# EAGLE design VPThermo (EAGLE 7.7.0)
Assembly variants: MAIN
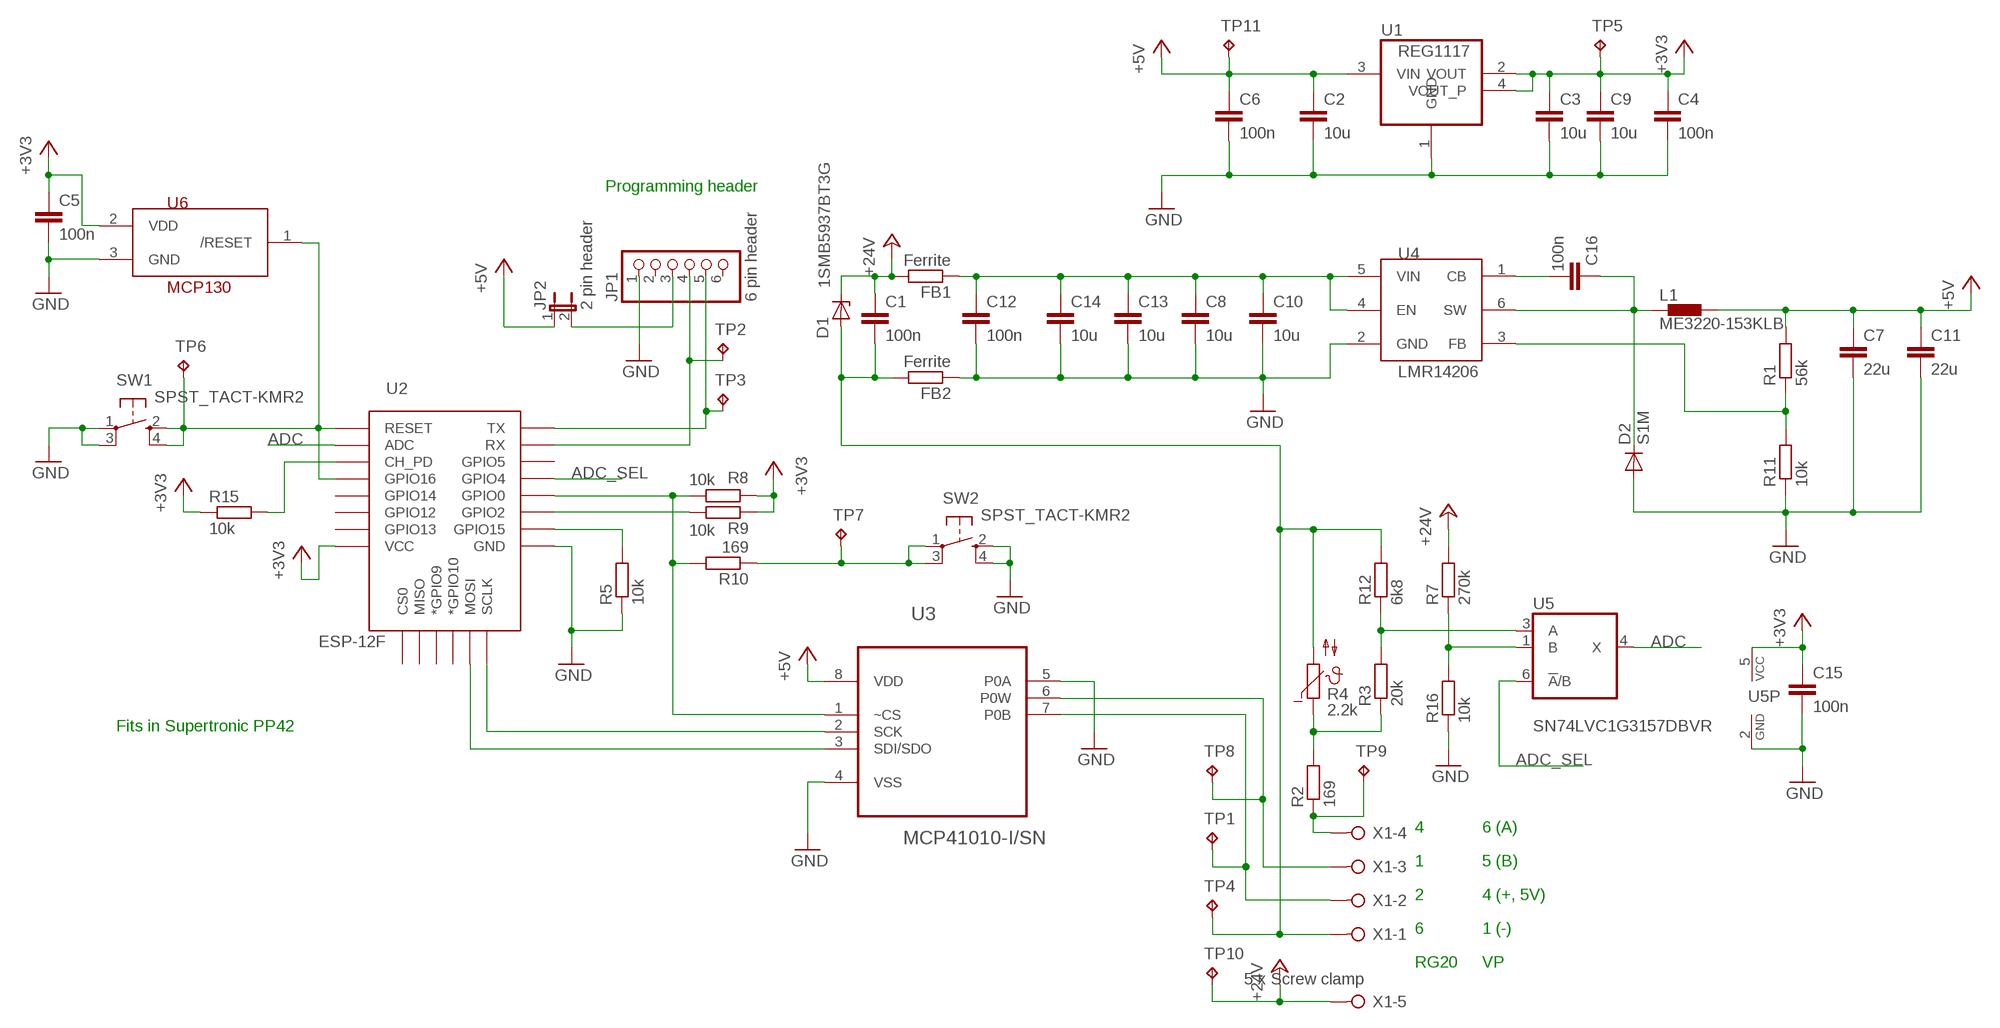
[diagram p0: schematic, sheet 1]

## Parts
C1  100n  C-EUC0603  [C0603]
C2  10u  C-EUC0805  [C0805]
C3  10u  C-EUC0805  [C0805]
C4  100n  C-EUC0603  [C0603]
C5  100n  C-EUC0603  [C0603]
C6  100n  C-EUC0603  [C0603]
C7  22u  C-EUC0805  [C0805]
C8  10u  C-EUC0805  [C0805]
C9  10u  C-EUC0805  [C0805]
C10  10u  C-EUC0805  [C0805]
C11  22u  C-EUC0805  [C0805]
C12  100n  C-EUC0603  [C0603]
C13  10u  C-EUC0805  [C0805]
C14  10u  C-EUC0805  [C0805]
C15  100n  C-EUC0603  [C0603]
C16  100n  C-EUC0603  [C0603]
D1  1SMB5937BT3G  ZENER-DIODESMB  [SMB]
D2  S1M  [SMA]
FB1  Ferrite  RR0603  [R0603]
FB2  Ferrite  RR0603  [R0603]
JP1  6 pin header  PINHD-1X6  [1X06]
JP2  2 pin header  JP1E  [JP1]
L1  ME3220-153KLB  SDR0302  [SDR0302]
R1  56k  RR0603  [R0603]
R2  169  RR0603  [R0603]
R3  20k  RR0603  [R0603]
R4  2.2k  NTC640  [P640]
R5  10k  RR0603  [R0603]
R7  270k  RR0603  [R0603]
R8  10k  RR0603  [R0603]
R9  10k  RR0603  [R0603]
R10  169  RR0603  [R0603]
R11  10k  RR0603  [R0603]
R12  6k8  RR0603  [R0603]
R15  10k  RR0603  [R0603]
R16  10k  RR0603  [R0603]
SW1  SPST_TACT-KMR2  [KMR2]
SW2  SPST_TACT-KMR2  [KMR2]
TP1  TPB1,27  [B1,27]  (not fitted in variant MAIN)
TP2  TPB1,27  [B1,27]  (not fitted in variant MAIN)
TP3  TPB1,27  [B1,27]  (not fitted in variant MAIN)
TP4  TPB1,27  [B1,27]  (not fitted in variant MAIN)
TP5  TPB1,27  [B1,27]  (not fitted in variant MAIN)
TP6  TPB1,27  [B1,27]  (not fitted in variant MAIN)
TP7  TPB1,27  [B1,27]  (not fitted in variant MAIN)
TP8  TPB1,27  [B1,27]  (not fitted in variant MAIN)
TP9  TPB1,27  [B1,27]  (not fitted in variant MAIN)
TP10  TPB1,27  [B1,27]  (not fitted in variant MAIN)
TP11  TPB1,27  [B1,27]  (not fitted in variant MAIN)
U1  REG1117  [SOT223]
U2  ESP-12F  ESP12ESMD  [ESP12E-SMD]  (not fitted in variant MAIN)
U3  MCP41010-I/SN  MCP4151-103E/SN  [SOIC127P600X175-8N]
U4  LMR14206  [SOT-23-6]
U5  SN74LVC1G3157DBVR  741G3157DBVR  [DBV_R-PDSO-G6]
U6  MCP130  [SOT23]
X1  5 x Screw clamp  W237-05P  [W237-5P]

## Nets
+3V3: C3.1 C4.1 C5.1 C9.1 C15.1 R8.1 R9.1 R15.1 TP5.TP U1.2(VOUT) U1.4(VOUT_P) U2.VCC U5.5(VCC) U6.2(VDD)
+5V: C2.1 C6.1 C7.1 C11.1 JP2.1 L1.2 R1.2 TP11.TP U1.3(VIN) U3.8(VDD)
+24V: C1.1 D1.C FB1.2 R7.2 TP10.TP X1.5
ADC: U2.ADC U5.4(X)
ADC_SEL: U2.GPIO4 U5.6(!A!/B)
GND: C2.2 C3.2 C4.2 C5.2 C6.2 C7.2 C8.2 C9.2 C10.2 C11.2 C12.2 C13.2 C14.2 C15.2 D2.A FB2.1 JP1.1 R5.1 R11.1 R16.1 SW1.1(P) SW1.3(P1) SW2.2(S) SW2.4(S1) U1.1(GND) U2.GND U3.4(VSS) U3.5(P0A) U4.2(GND) U5.2(GND) U6.3(GND)
N$1: R10.1 SW2.1(P) SW2.3(P1) TP7.TP
N$2: U2.MOSI U3.3(SDI/SDO)
N$3: C16.2 U4.1(CB)
N$4: JP1.3 JP2.2
N$5: U2.SCLK U3.2(SCK)
N$6: JP1.4 TP2.TP U2.RXD0(RX)
N$7: JP1.5 TP3.TP U2.TXD0(TX)
N$9: R3.2 R12.1 U5.3(A)
N$10: TP8.TP U3.6(P0W) X1.3
N$11: R2.2 R3.1 R4.1
N$12: R2.1 TP9.TP X1.4
N$13: R5.2 U2.GPIO15
N$14: C8.1 C10.1 C12.1 C13.1 C14.1 FB1.1 U4.4(EN) U4.5(VIN)
N$15: TP1.TP U3.7(P0B) X1.2
N$16: R8.2 R10.2 U2.GPIO0 U3.1(~CS)
N$17: R9.2 U2.GPIO2
N$18: C1.2 D1.A FB2.2 R4.2 R12.2 TP4.TP X1.1
N$19: R1.1 R11.2 U4.3(FB)
N$20: R15.2 U2.CH_PD
N$21: R7.1 R16.2 U5.1(B)
N$22: SW1.2(S) SW1.4(S1) TP6.TP U2.GPIO16 U2.RESET U6.1(/RESET)
N$23: C16.1 D2.C L1.1 U4.6(SW)
Unconnected: JP1.2 JP1.6 U2.CS0 U2.GPIO5 U2.GPIO9(*GPIO9) U2.GPIO10(*GPIO10) U2.GPIO12 U2.GPIO13 U2.GPIO14 U2.MISO

## Notes on the sheet
- Programming header
- Fits in Supertronic PP42
- 4 | 6 (A)
- 1 | 5 (B)
- 2 | 4 (+, 5V)
- 6 | 1 (-)
- RG20 | VP

## Library data of the parts
C1 C4-C6 C12 C15 C16 = rcl:C-EU: CAPACITOR, European symbol; OC_FARNELL: 1759122
C2 C3 C8-C10 C13 C14 = resistor:C-EU: CAPACITOR, European symbol; OC_FARNELL: 2611943
C7 C11 = resistor:C-EU: CAPACITOR, European symbol; OC_FARNELL: 2309030
D1 = diode:ZENER-DIODE: Z-Diode; OC_FARNELL: 1431179
D2 = diode:S1M
FB1 FB2 = eagle-ltspice:R: RESISTOR, European symbol; OC_FARNELL: 1635706; SPICEMODEL: NONE; SPICEPREFIX: R
JP1 = adafruit:PINHD-1X6: PIN HEADER; OC_FARNELL: 1593415
JP2 = jumper:JP1E: JUMPER; OC_FARNELL: 1593411
L1 = ola_inductor:SDR0302; OC_FARNELL: 2287926
R1 = eagle-ltspice:R: RESISTOR, European symbol; OC_FARNELL: 2303215; SPICEMODEL: NONE; SPICEPREFIX: R
R2 R10 = eagle-ltspice:R: RESISTOR, European symbol; OC_FARNELL: 2303081; SPICEMODEL: NONE; SPICEPREFIX: R
R3 = eagle-ltspice:R: RESISTOR, European symbol; OC_FARNELL: 2447293; SPICEMODEL: NONE; SPICEPREFIX: R
R4 = ptc-ntc:NTC640: PHILIPS NTC; OC_FARNELL: 1187025; OC_NEWARK: unknown
R5 R8 R9 R11 R15 R16 = eagle-ltspice:R: RESISTOR, European symbol; OC_FARNELL: 2447230; SPICEMODEL: NONE; SPICEPREFIX: R
R7 = eagle-ltspice:R: RESISTOR, European symbol; OC_FARNELL: 2447313; SPICEMODEL: NONE; SPICEPREFIX: R
R12 = eagle-ltspice:R: RESISTOR, European symbol; OC_FARNELL: 2447427; SPICEMODEL: NONE; SPICEPREFIX: R
SW1 SW2 = adafruit:SPST_TACT: SMT 6mm switch, EVQQ2 series http://www.ladyada.net/library/eagle; OC_FARNELL: 1437636
TP1-TP11 = testpad:TP: Test pad
U1 = burr-brown:REG1117: 800mA and 1A Low Dropout (LDO) Positive Regulator 1.8V, 2.5V, 2.85V, 3.3V, 5V, and Adj; MPN: REG1117; OC_FARNELL: 1825376; OC_NEWARK: 14P6981
U2 = esp8266modules:ESP12E: ESP12E Module
U3 = digitalpot-microchip:MCP4151-103E/SN: Digital POT; MPN: MCP41010-I/SN; OC_FARNELL: 9758607; PACKAGE: SOIC-8; SUPPLIER: Microchip
U4 = ola_texas:LMR14206: LMR14206 SIMPLE SWITCHER® 42Vin, 0.6A Step-Down Voltage Regulator in SOT-23
U5 = 74xx-little-us:74*1G3157: Single-Pole, Double-Throw Analog Switch Source: http://focus.ti.com/lit/ds/symlink/sn74lvc1g3157.pdf; OC_FARNELL: 1470910
U6 = ola-microchip:MCP130
X1 = con-wago-508:W237-05P: WAGO SREW CLAMP; OC_FARNELL: 1717004; OC_NEWARK: unknown

## Board
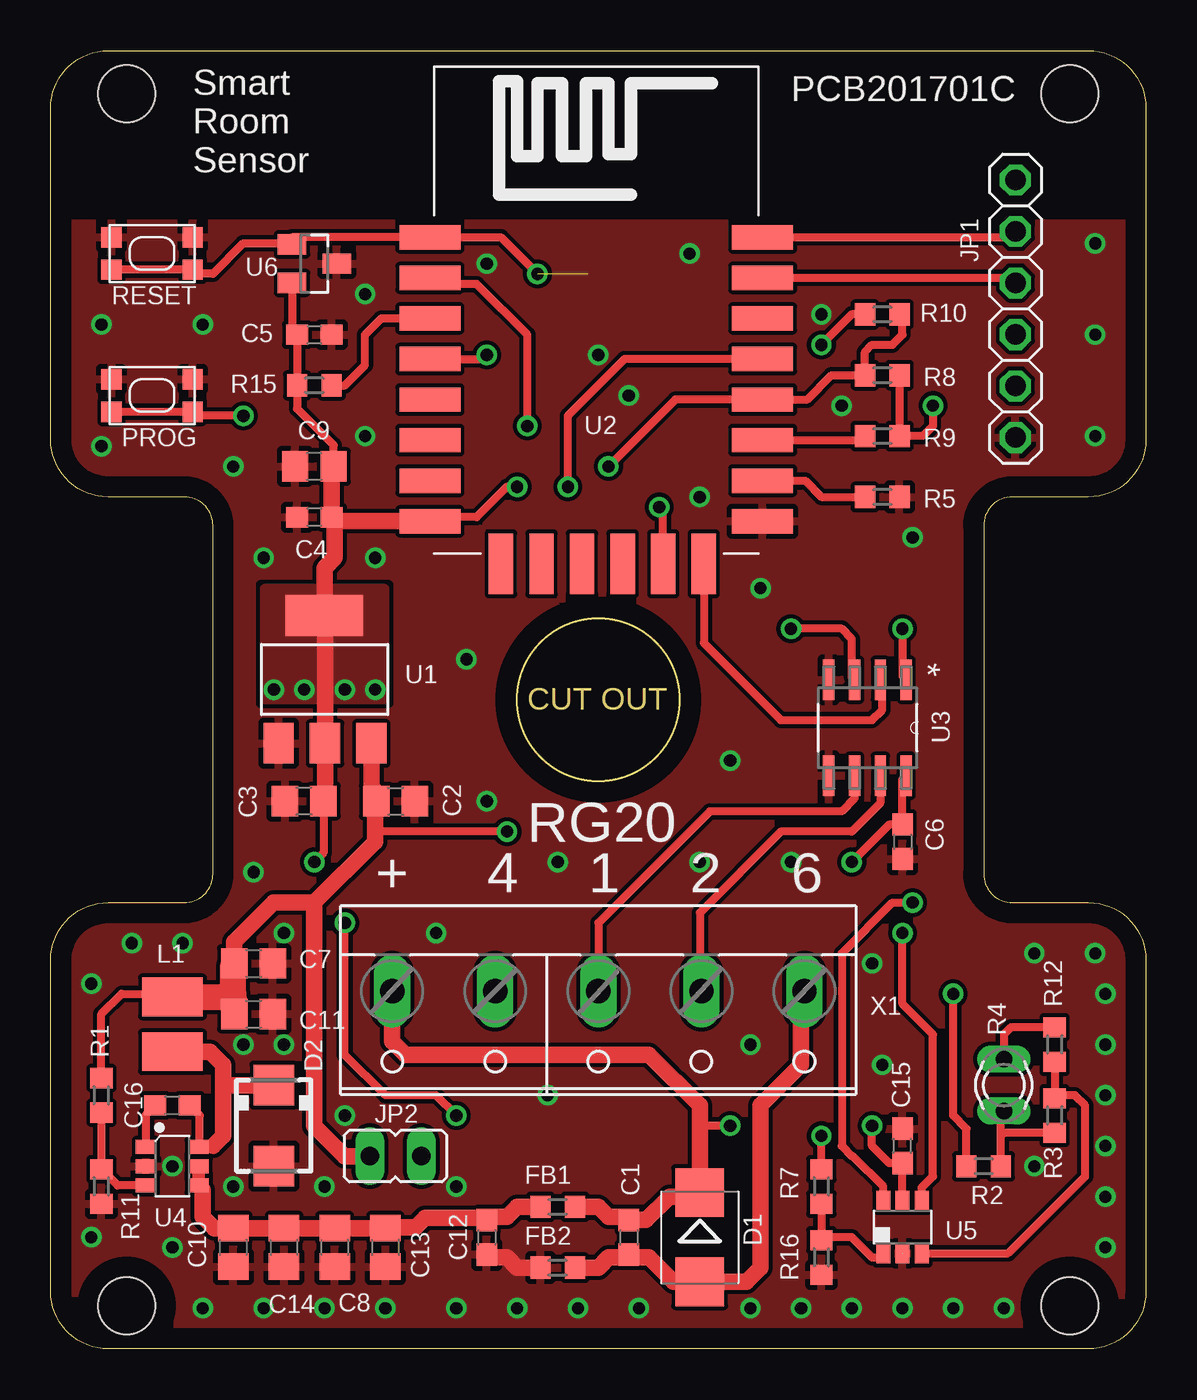
[diagram p1: board, top side]
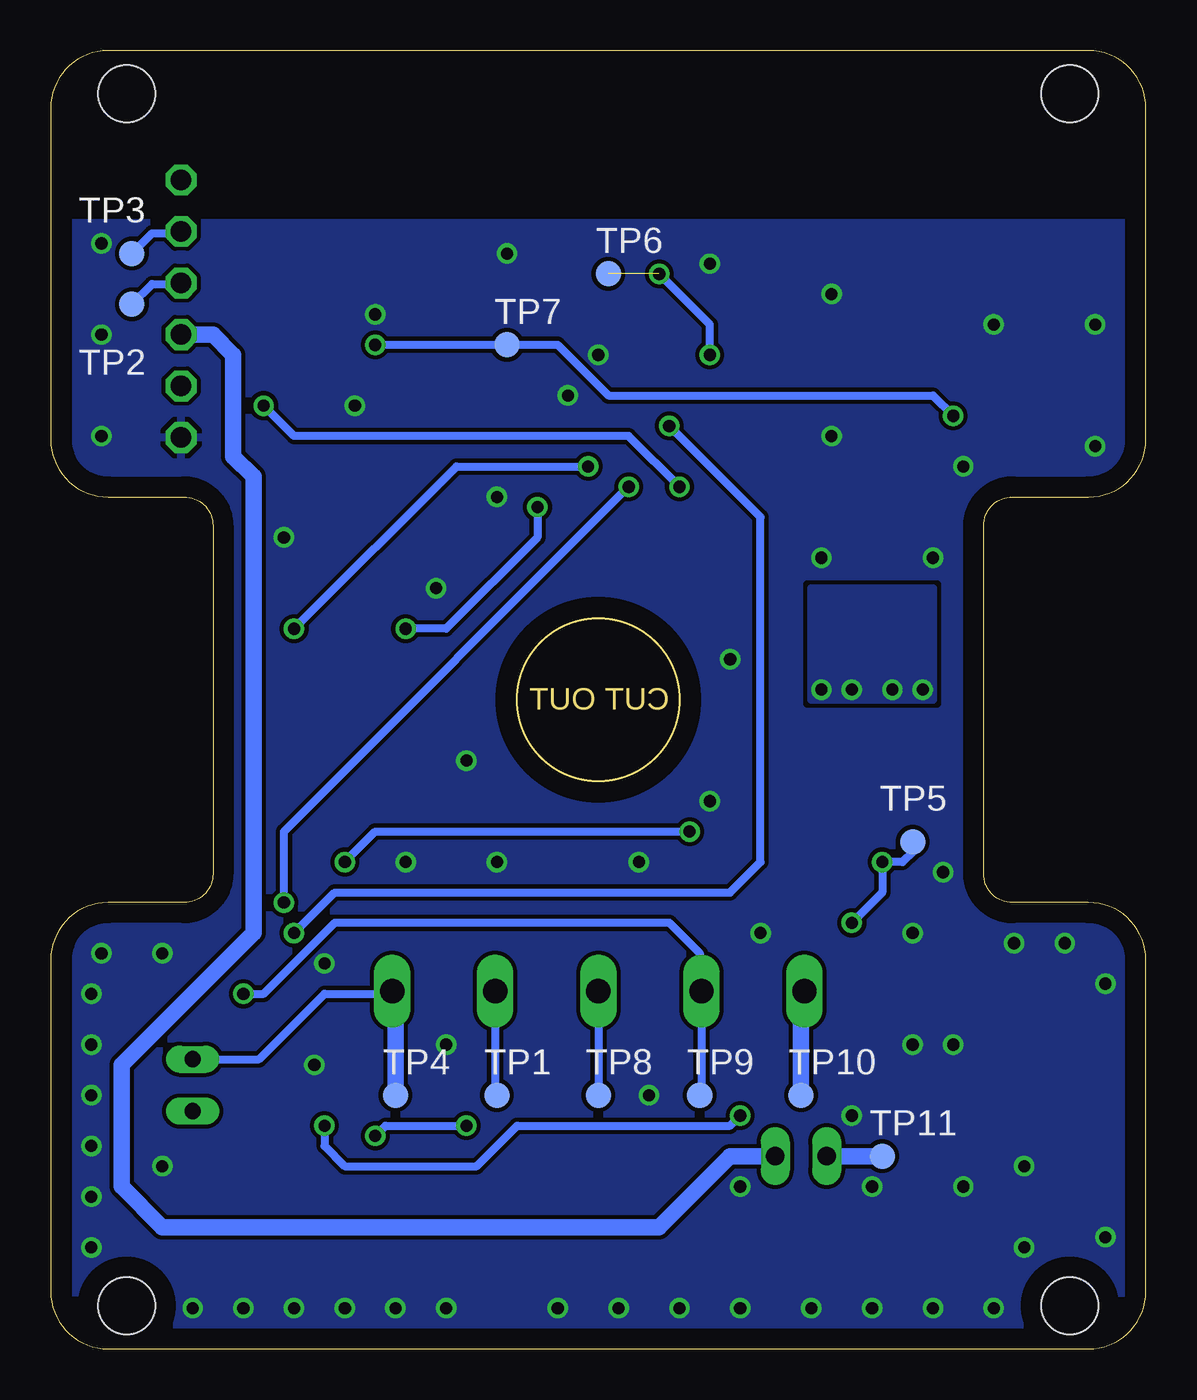
[diagram p2: board, bottom side, seen from below]

Size 54 x 64 mm. Coordinates in mm from the lower left corner, seen from the top.
Outline: 54,19.17 54,2.83 arc-90 51.17,0 2.83,0 arc-90 0,2.83 0,19.17 arc-90 2.83,22 6.59,22 arc90 8,23.41 8,40.59 arc90 6.59,42 2.83,42 arc-90 0,44.83 0,61.17 arc-90 2.83,64 51.17,64 arc-90 54,61.17 54,44.83 arc-90 51.17,42 47.41,42 arc90 46,40.59 46,23.41 arc90 47.41,22 51.17,22 arc-90 54,19.17
Outline: circle at 27,32 radius 4
Copper layers (1*16): Top 0.035mm / dielectric 0.8mm / Bottom 0.035mm
Design rules "default *": minimum track width 10mil, minimum drill 10mil, track to track 8mil, track to pad 8mil, pad to pad 8mil, via to via 8mil, smd to smd 8mil, copper to edge 40mil, drill to drill 8mil, minimum pad ring 10mil, minimum via ring 8mil, stop-mask expansion 4mil, vias tented up to drill 0.6mm, thermal gap 10mil
Holes 2.8 mm at 3.75,2.12 50.25,2.12 50.25,61.88 3.75,61.88

### Footprints (pad centres in the part's own frame; a part is rotated, then mirrored left to right if it is on the bottom)
C0603 = smd 1.1 x 1: 1 -0.85,0; 2 0.85,0
C0805 = smd 1.3 x 1.5: 1 -0.95,0; 2 0.95,0
SMB = smd 2.4 x 2.4: A 2.2,0; C -2.2,0
SMA = smd 2 x 2: A 2,0; C -2,0
R0603 = smd 1 x 1.1: 1 -0.85,0; 2 0.85,0
1X06 = drill 1.016 octagon: 1 -6.35,0; 2 -3.81,0; 3 -1.27,0; 4 1.27,0; 5 3.81,0; 6 6.35,0
JP1 = drill 0.914 long: 1 0,-1.27; 2 0,1.27
SDR0302 = smd 3 x 1.9: 1 0,-1.35; 2 0,1.35
P640 = drill 0.813 long: 1 -1.27,0; 2 1.27,0
KMR2 = smd 1 x 1: 1 2,0.8; 2 2,-0.8; 3 -2,0.8; 4 -2,-0.8
B1,27 = smd 1.27 x 1.27: TP 0,0
SOT223 = smd 1.499 x 2.007: 1 -2.261,-3.15; 2 0.025,-3.15; 3 2.311,-3.15 | smd 3.81 x 2.007: 4 0,3.15
ESP12E-SMD = smd 3 x 1.2: ADC -8.3,3.8; CH_PD -8.3,1.8; GND 8.1,-8.2; GPIO0 8.1,-2.2; GPIO2 8.1,-4.2; GPIO4 8.1,-0.2; GPIO5 8.1,1.8; GPIO12 -8.3,-4.2; GPIO13 -8.3,-6.2; GPIO14 -8.3,-2.2; GPIO15 8.1,-6.2; GPIO16 -8.3,-0.2; RESET -8.3,5.8; RXD0 8.1,3.8; TXD0 8.1,5.8; VCC -8.3,-8.2 | smd 1.2 x 3: CS0 -4.8,-10.3; GPIO9 -0.8,-10.3; GPIO10 1.2,-10.3; MISO -2.8,-10.3; MOSI 3.2,-10.3; SCLK 5.2,-10.3
SOIC127P600X175-8N = smd 1.981 x 0.559: 1 -2.362,1.905; 2 -2.362,0.635; 3 -2.362,-0.635; 4 -2.362,-1.905; 5 2.362,-1.905; 6 2.362,-0.635; 7 2.362,0.635; 8 2.362,1.905
SOT-23-6 = smd 0.69 x 1: 1 -0.95,-1.3; 2 0,-1.3; 3 0.95,-1.3; 4 0.95,1.3; 5 0,1.3; 6 -0.95,1.3
DBV_R-PDSO-G6 = smd 0.69 x 0.99: 1 -0.95,-1.29; 2 0,-1.29; 3 0.95,-1.29; 4 0.95,1.3; 5 0,1.3; 6 -0.95,1.3
SOT23 = smd 1 x 1.4: 1 -0.95,-1.1; 2 0.95,-1.1; 3 0,1.1
W237-5P = drill 1.194 long: 1 -10.16,-0.635; 2 -5.08,-0.635; 3 0,-0.635; 4 5.08,-0.635; 5 10.16,-0.635

### Placement (x,y rotation side)
C1  28.5,5.5 270 top
C2  17,27 0 top
C3  12.5,27 180 top
C4  13,41 180 top
C5  13,50 0 top
C6  42,25 270 top
C7  10,19 0 top
C8  14,5 270 top
C9  13,43.5 180 top
C10  9,5 270 top
C11  10,16.5 0 top
C12  21.5,5.5 270 top
C13  16.5,5 270 top
C14  11.5,5 270 top
C15  42,10 90 top
C16  6,12 180 top
D1  32,5.5 270 top
D2  11,11 270 top
FB1  25,7 0 top
FB2  25,4 0 top
JP1  47.57,51.28 90 top
JP2  17,9.5 270 top
L1  6,16 0 top
R1  2.5,12.5 90 top
R2  46,9 0 top
R3  49.5,11.5 90 top
R4  47,13 90 top
R5  41,42 180 top
R7  38,8 90 top
R8  41,48 180 top
R9  41,45 180 top
R10  41,51 0 top
R11  2.5,8 90 top
R12  49.5,15 90 top
R15  13,47.5 0 top
R16  38,4.5 90 top
SW1  5,54 0 top
SW2  5,47 180 top
TP1  32,12.5 0 bottom
TP2  50,51.5 0 bottom
TP3  50,54 0 bottom
TP4  37,12.5 0 bottom
TP5  11.5,25 0 bottom
TP6  26.5,53 0 bottom
TP7  31.5,49.5 0 bottom
TP8  27,12.5 0 bottom
TP9  22,12.5 0 bottom
TP10  17,12.5 0 bottom
TP11  13,9.5 0 bottom
U1  13.5,33 0 top
U2  27,49 0 top
U3  40.27,30.62 270 top
U4  6,9 270 top
U5  42,6 0 top
U6  13,53.5 270 top
X1  27,17 180 top

### Tracks (layer width: path | path; a pad name or v marks a point on that pad's centre or on a via)
+3V3  (via drill 0.6)
  Top 0.406: R8.1 R9.1 43,45 43.5,45.5 v43.5,46.5 | v23,42.5 22.5,42.5 21,41 18.9,41 U2.VCC | C3.1 13.45,24.45 v13,24 | U5.5 C15.1 41.35,9.15 40.5,10 v40.5,11 | v20,11.5 19,12.5 16.5,12.5 14.5,14.5 v14.5,21 | U6.2 11.9,50.25 C5.1 R15.1 12.15,46.35 13.95,44.55 C9.1
  Top 0.813: U2.VCC 14.05,40.8 C4.1 | C4.1 14,40.85 14,39 13.5,38.5 U1.4 13.53,36.12 U1.2 13.53,27.07 C3.1 | C4.1 13.85,43.4 C9.1
  Bottom 0.406: v23,42.5 25.5,45 42,45 v43.5,46.5 | v40.5,11 40.5,10 39.5,9 33,9 31,11 20.5,11 v20,11.5 | TP5.TP 11.5,24.5 12,24 v13,24 13,22.5 v14.5,21
  other vias: 12.5,32.5 14.5,32.5 16,32.5 11,32.5
  pour Top (isolate 0.406, no thermals): 10.5,32 16.5,32 16.5,37.5 10.5,37.5
  pour Bottom (isolate 0.406, no thermals): 10.5,32 16.5,32 16.5,37.5 10.5,37.5
+5V  (via drill 0.6)
  Top 0.406: U3.8 42,28.08 C6.1 41.35,25.85 v39.5,24 | v22.5,25.5 16,25.5 | R1.2 2.5,16.5 3.5,17.5 5.85,17.5 L1.2
  Top 0.813: 15.71,9.48 JP2.1 14.5,9.5 13,11 13,22 | 13,22 16,25 16,25.5 16,26.95 C2.1 16,27.05 16,27.5 15.81,27.69 U1.3 | C7.1 9.05,20.05 11,22 13,22
  Top 1.27: L1.2 8.85,17.35 | 8.85,17.35 9,17.5 9,18.95 C7.1 | C11.1 9.05,17.15 8.85,17.35
  Bottom 0.406: v39.5,24 38,25.5 v22.5,25.5
  Bottom 0.813: TP11.TP JP2.1
+24V  (via drill 0.6)
  Top 0.406: v33.5,11 32,11 | R7.2 v38,10.5
  Top 0.813: X1.5 16.84,15.16 17.5,14.5 29.5,14.5 32,12 32,11 D1.C 31.8,7.5 30.5,7.5 29.35,6.35 C1.1 28.35,6.5 27.5,6.5 27,7 FB1.2
  Bottom 0.406: v33.5,11 37.5,11 v38,10.5
  Bottom 0.813: TP10.TP 17,17.48 X1.5
ADC  (via drill 0.6)
  Top 0.406: U2.ADC 19,52.5 21,52.5 23.5,50 v23.5,45.5 | v42,20.5 42,17 43.5,15.5 43.5,8.5 42.95,7.95 U5.4
  Bottom 0.406: v23.5,45.5 19,41 19,24 20.5,22.5 40,22.5 v42,20.5
ADC_SEL  (via drill 0.6)
  Top 0.406: U2.GPIO4 28.3,48.8 25.5,46 v25.5,42.5 | U5.6 41.05,8 39.55,9.5 39.5,9.5 39,10 39,19.5 41.5,22 v42.5,22
  Bottom 0.406: v25.5,42.5 42.5,25.5 v42.5,22
GND  (via drill 0.6)
  Top 0.813: FB2.1 23,4 22.5,4.5 21.65,4.5 C12.2
  other vias: 51.5,19.5 52,7.5 47,2 7.5,2 10.5,39 2.5,44.5 51.5,45 51.5,54.5 2.5,50.5 32,42 42.5,40 9,43.5 21.5,53.5 31.5,54 38,51 21.5,27 33.5,29 20.5,34 20,2 16.5,2 29,2 13.5,2 26,2 35,37.5 15.5,45 39,46.5 16,39 10.5,2 34.5,2 37,2 39.5,2 42,2 44.5,2 51.5,50 27,49 7.5,50.5 24.5,12.5 52,10 48.5,19.5 23,2 14.5,11.5 52,5 28.5,47 48.5,9 41,14 40.5,19 52,12.5 52,15 52,17.5 34.5,15 19,20.5 25,24 32,24 36.5,24 11.5,20.5 11.5,15 9,8 13.5,8 2,5.5 2,18 4,20 6.5,20 6,5 10,23.5 6,9 15.5,52 9.5,15 20,8
  pour Top (rank 2): 1,55.5 53,55.5 53,43 47.83,43 arc90 45,40.17 45,23.83 arc90 47.83,21 53,21 53,1 1,1 1,21 6.17,21 arc90 9,23.83 9,40.17 arc90 6.17,43 1,43
  pour Bottom (rank 2): 1,55.5 53,55.5 53,43 47.83,43 arc90 45,40.17 45,23.83 arc90 47.83,21 53,21 53,1 1,1 1,21 6.17,21 arc90 9,23.83 9,40.17 arc90 6.17,43 1,43
N$1  (via drill 0.6)
  Top 0.406: SW2.1 SW2.3 7.2,46 v9.5,46 | R10.1 39.5,51 v38,49.5
  Bottom 0.406: v38,49.5 TP7.TP 29,49.5 26.5,47 10.5,47 v9.5,46
N$2  (via drill 0.6)
  Top 0.406: U2.MOSI 30.2,41.3 v30,41.5 | U3.3 39.5,33.12 39.5,35 39,35.5 v36.5,35.5
  Bottom 0.406: v30,41.5 30,40 34.5,35.5 v36.5,35.5
N$3
  Top 0.406: U4.1 4.7,11.55 C16.2
N$4
  Bottom 0.813: JP1.3 46,50 45,49 45,44 44,43 44,20.5 50.5,14 50.5,8 48.5,6 24,6 20.5,9.5 JP2.2
N$5
  Top 0.406: U2.SCLK 32.2,34.8 36,31 40.5,31 41,31.5 41,32.89 U3.2
N$6
  Top 0.406: U2.RXD0 47.32,52.8 JP1.4
  Bottom 0.406: TP2.TP 49,52.5 47.62,52.5 JP1.4
N$7
  Top 0.406: U2.TXD0 47.28,54.8 JP1.5
  Bottom 0.406: TP3.TP 49,55 47.66,55 JP1.5
N$9
  Top 0.406: U5.3 47.21,4.71 51,8.5 51,12 50.5,12.5 49.65,12.5 R3.2 R12.1
N$10
  Top 0.406: U3.6 39.63,27.14 39,26.5 32.5,26.5 27,21 X1.3
  Bottom 0.406: X1.3 TP8.TP
N$11
  Top 0.406: R2.2 46.85,10.5 | 46.85,10.5 46.85,11.58 R4.1 | R3.1 47,10.65 46.85,10.5
N$12  (via drill 0.6)
  Top 0.406: R2.1 45.15,10.85 44.5,11.5 v44.5,17.5
  Bottom 0.406: TP9.TP 21.92,12.58 X1.4 22,17.71 22,19.5 23.5,21 40,21 43.5,17.5 v44.5,17.5
N$13
  Top 0.406: U2.GPIO15 37.2,42.8 38,42 R5.2
N$14
  Top 0.61: U4.4 U4.5
  Top 0.813: FB1.1 23,7 22.5,6.5 21.65,6.5 C12.1 21.4,6.45 18.45,6.45 18,6 16.55,6 C13.1 C8.1 C14.1 C10.1 8.05,5.95 7.5,6.5 7.5,7.85 U4.4
N$15
  Top 0.406: U3.7 40.91,26.91 39.5,25.5 36,25.5 32,21.5 32,17.71 X1.2
  Bottom 0.406: X1.2 32.08,12.58 TP1.TP
N$16  (via drill 0.6)
  Top 0.406: v42,35.5 42,33.16 U3.1 | R10.2 42,50.85 42,50 41.5,49.5 40.5,49.5 40.15,49.15 R8.2 38.5,48 37.3,46.8 U2.GPIO0 30.8,46.8 v27.5,43.5
  Bottom 0.406: v42,35.5 34,43.5 v27.5,43.5
N$17
  Top 0.406: U2.GPIO2 39.95,44.8 R9.2
N$18
  Top 0.406: R12.2 47.35,15.85 47,15.5 R4.2
  Top 0.813: D1.A 30.7,3.3 29.5,4.5 28.65,4.5 C1.2 28.35,4.5 27.5,4.5 27,4 FB2.2 | 32.5,3 32.3,3 D1.A | 37.5,17.3 X1.1 37,17.48 37,14 35,12 35,4 34.3,3.3 D1.A
  Bottom 0.406: R4.2 43.73,14.27 40.5,17.5 37.3,17.5 X1.1
  Bottom 0.813: TP4.TP 37,17.48 X1.1
N$19
  Top 0.406: R1.1 R11.2 3.3,8.05 U4.3
N$20
  Top 0.406: R15.2 14.5,47.5 15.5,48.5 15.5,50 16.3,50.8 U2.CH_PD
N$21
  Top 0.406: U5.1 40.84,4.5 40.5,4.5 39.5,5.5 38.15,5.5 R16.2 R7.1
N$22  (via drill 0.6)  (1 unrouted)
  Top 0.406: SW1.4 SW1.2 7.2,53 8,53 9.5,54.5 11.85,54.5 U6.1 11.9,54.8 U2.RESET 22.2,54.8 v24,53 | U2.GPIO16 21.3,48.8 v21.5,49
  Bottom 0.406: v21.5,49 21.5,50.5 v24,53
N$23
  Top 0.406: 7.35,10 7.35,11.5 C16.1
  Top 0.61: 8,10 7.35,10 U4.6
  Top 0.813: L1.1 7.85,14.65 8.5,14 8.5,13 | 8.5,13 8.5,10.5 8,10 | D2.C 8.5,13

### Text on the board
Dimension: CUT OUT
_tsilk: PCB201701C | Smart / Room / Sensor | RESET | PROG | RG20 | + | 4 | 1 | 2 | 6